# Altium project oscistack.PrjPcb
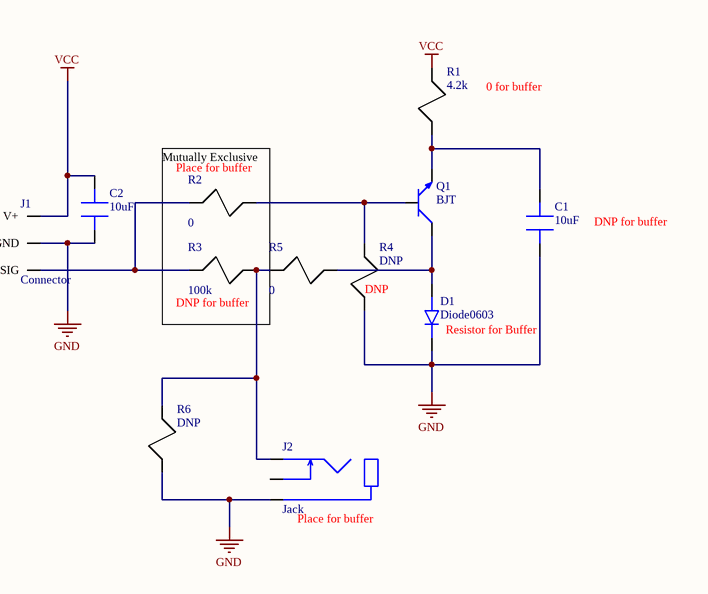
[diagram p0: oscistack.SchDoc]
1 sheet, 12 parts. Net scope: global (net labels, ports and power ports of the same name join across sheets).
Board file: oscistack.PcbDoc

## Sheet oscistack.SchDoc
size A

### Parts
C1  10uF  [Res0603]
C2  10uF  [Res0603]
D1  Diode0603  [LED0603]
J1  Connector  [Header1x3]
J2  Jack
Q1  BJT  [BJT]
R1  4.2k  [Res0603]
R2  0  [Res0603]
R3  100k  [Res0603]
R4  DNP  [Res0603]
R5  0  [Res0603]
R6  DNP  [Res0603]

### Nets
GND: C1.2 C2.2 D1.K J1.GND J2.S R4.2 R6.2
VCC: C2.1 J1.V+ R1.1
NetC1_1: C1.1 Q1.E R1.2
NetD1_A: D1.A Q1.C R5.1
NetJ1_SIG: J1.SIG R2.1 R3.1
NetJ2_T: J2.T R3.2 R5.2 R6.1
NetQ1_B: Q1.B R2.2 R4.1

Not connected (* = marked no-connect by the designer): J2 SW

### Notes on the sheet
- 0 for buffer
- (near R2) Place for buffer
- DNP for buffer
- Mutually Exclusive
- (near R4) DNP
- (near D1) Resistor for Buffer
- (near J2) Place for buffer

### Library data of the parts
C1 C2 = Cap0603
R1-R6 = Res0603